# EAGLE design slidi (EAGLE 6.4)
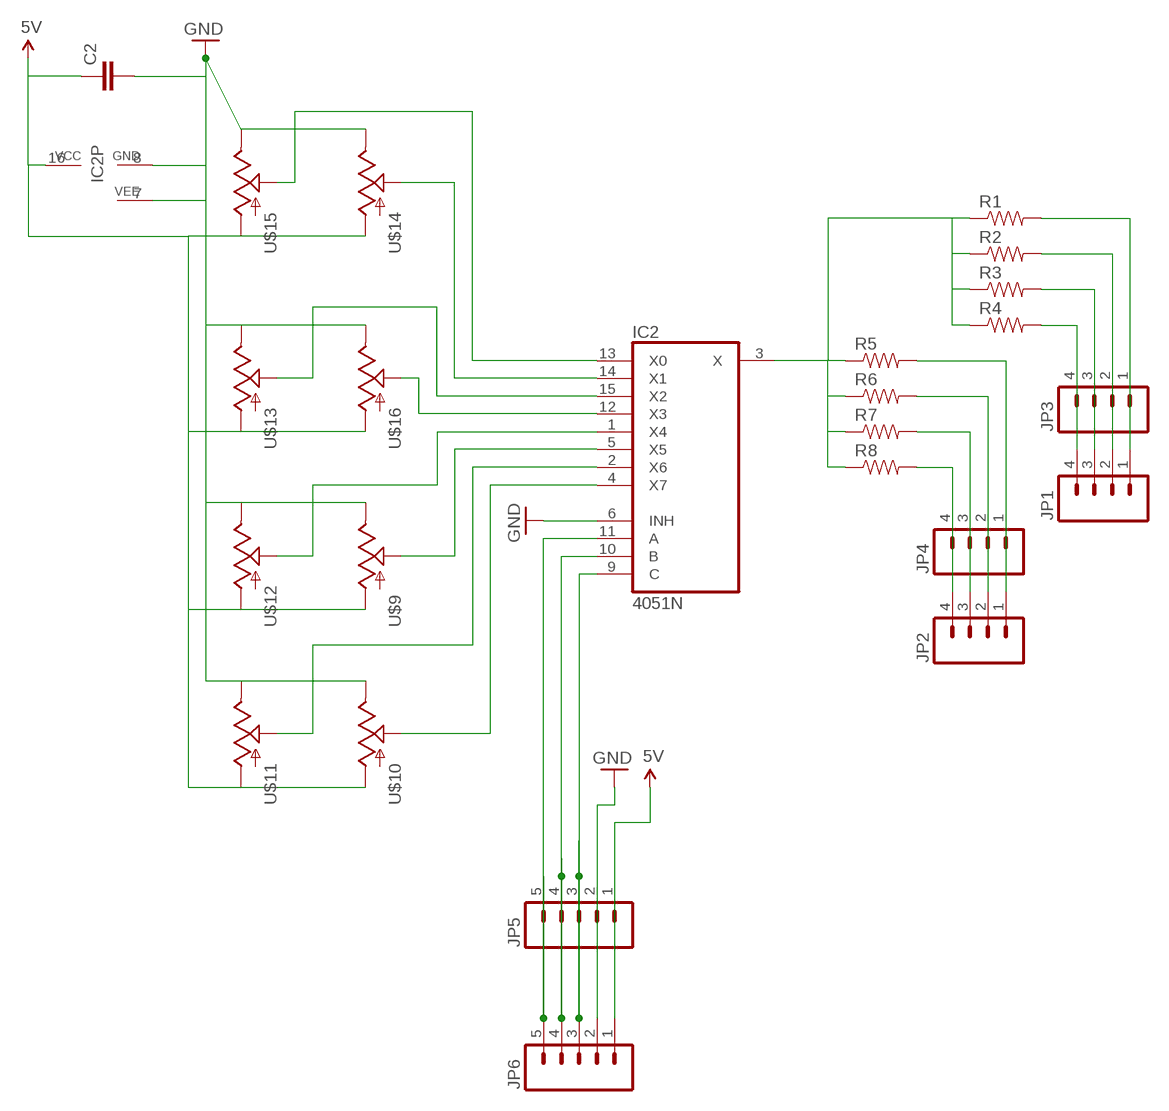
[diagram p0: schematic, sheet 1]

## Parts
C2  CAPPTH  [CAP-PTH-SMALL]
IC2  4051N  [DIL16]
JP1  M04PTH  [1X04]
JP2  M04PTH  [1X04]
JP3  M04PTH  [1X04]
JP4  M04PTH  [1X04]
JP5  M05PTH  [1X05]
JP6  M05PTH  [1X05]
R1  RESISTORAXIAL-0.3  [AXIAL-0.3]
R2  RESISTORAXIAL-0.3  [AXIAL-0.3]
R3  RESISTORAXIAL-0.3  [AXIAL-0.3]
R4  RESISTORAXIAL-0.3  [AXIAL-0.3]
R5  RESISTORAXIAL-0.3  [AXIAL-0.3]
R6  RESISTORAXIAL-0.3  [AXIAL-0.3]
R7  RESISTORAXIAL-0.3  [AXIAL-0.3]
R8  RESISTORAXIAL-0.3  [AXIAL-0.3]
U$9  SLIDEPOT  [SLIDEPOT]
U$10  SLIDEPOT  [SLIDEPOT]
U$11  SLIDEPOT  [SLIDEPOT]
U$12  SLIDEPOT  [SLIDEPOT]
U$13  SLIDEPOT  [SLIDEPOT]
U$14  SLIDEPOT  [SLIDEPOT]
U$15  SLIDEPOT  [SLIDEPOT]
U$16  SLIDEPOT  [SLIDEPOT]

## Nets
5V: C2.1 IC2.16(VCC) JP5.1 JP6.1 U$9.GND(A) U$10.GND(A) U$11.GND(A) U$12.GND(A) U$13.GND(A) U$14.GND(A) U$15.GND(A) U$16.GND(A)
GND: C2.2 IC2.6(INH) IC2.7(VEE) IC2.8(GND) JP5.2 JP6.2 U$9.5V(E) U$10.5V(E) U$11.5V(E) U$12.5V(E) U$13.5V(E) U$14.5V(E) U$15.5V(E) U$16.5V(E)
N$1: IC2.14(X1) U$14.WIPER(S)
N$9: IC2.13(X0) U$15.WIPER(S)
N$11: IC2.15(X2) U$13.WIPER(S)
N$12: IC2.12(X3) U$16.WIPER(S)
N$13: IC2.1(X4) U$12.WIPER(S)
N$14: IC2.5(X5) U$9.WIPER(S)
N$15: IC2.2(X6) U$11.WIPER(S)
N$16: IC2.4(X7) U$10.WIPER(S)
N$17: IC2.3(X) R1.P$1 R2.P$1 R3.P$1 R4.P$1 R5.P$1 R6.P$1 R7.P$1 R8.P$1
N$18: IC2.10(B) JP5.4 JP6.4
N$19: IC2.11(A) JP5.5 JP6.5
N$20: IC2.9(C) JP5.3 JP6.3
N$21: JP1.4 JP3.4 R4.P$2
N$22: JP1.3 JP3.3 R3.P$2
N$23: JP1.2 JP3.2 R2.P$2
N$24: JP1.1 JP3.1 R1.P$2
N$26: JP2.4 JP4.4 R8.P$2
N$27: JP2.3 JP4.3 R7.P$2
N$28: JP2.2 JP4.2 R6.P$2
N$29: JP2.1 JP4.1 R5.P$2

## Library data of the parts
C2 = SparkFun-Passives:CAP: Capacitor Standard 0603 ceramic capacitor, and 0.1" leaded capacitor.
IC2 = 40xx:4051: 8-channel ANALOG MULTIPLEXER
JP1-JP4 = SparkFun-Connectors:M04: Header 4 Standard 4-pin 0.1" header. Use with straight break away headers (SKU : PRT-00116), right angle break away headers (PRT-00553), swiss pins (PRT-00743), machine pins (PRT-00117), and female headers (PRT-00115). Molex polarized connector foot print use with SKU : PRT-08231 with associated crimp pins and housings. 1MM SMD Version SKU: PRT-10208
JP5 JP6 = SparkFun-Connectors:M05: Header 5 Standard 5-pin 0.1" header. Use with straight break away headers (SKU : PRT-00116), right angle break away headers (PRT-00553), swiss pins (PRT-00743), machine pins (PRT-00117), and female headers (PRT-00115). Molex polarized connector foot print use with SKU : PRT-08230 with associated crimp pins and housings.
R1-R8 = SparkFun-Resistors:RESISTOR: Resistor Basic schematic elements and footprints for 0603, 1206, and PTH resistors.
U$9-U$16 = slidepot:SLIDEPOT

## Board
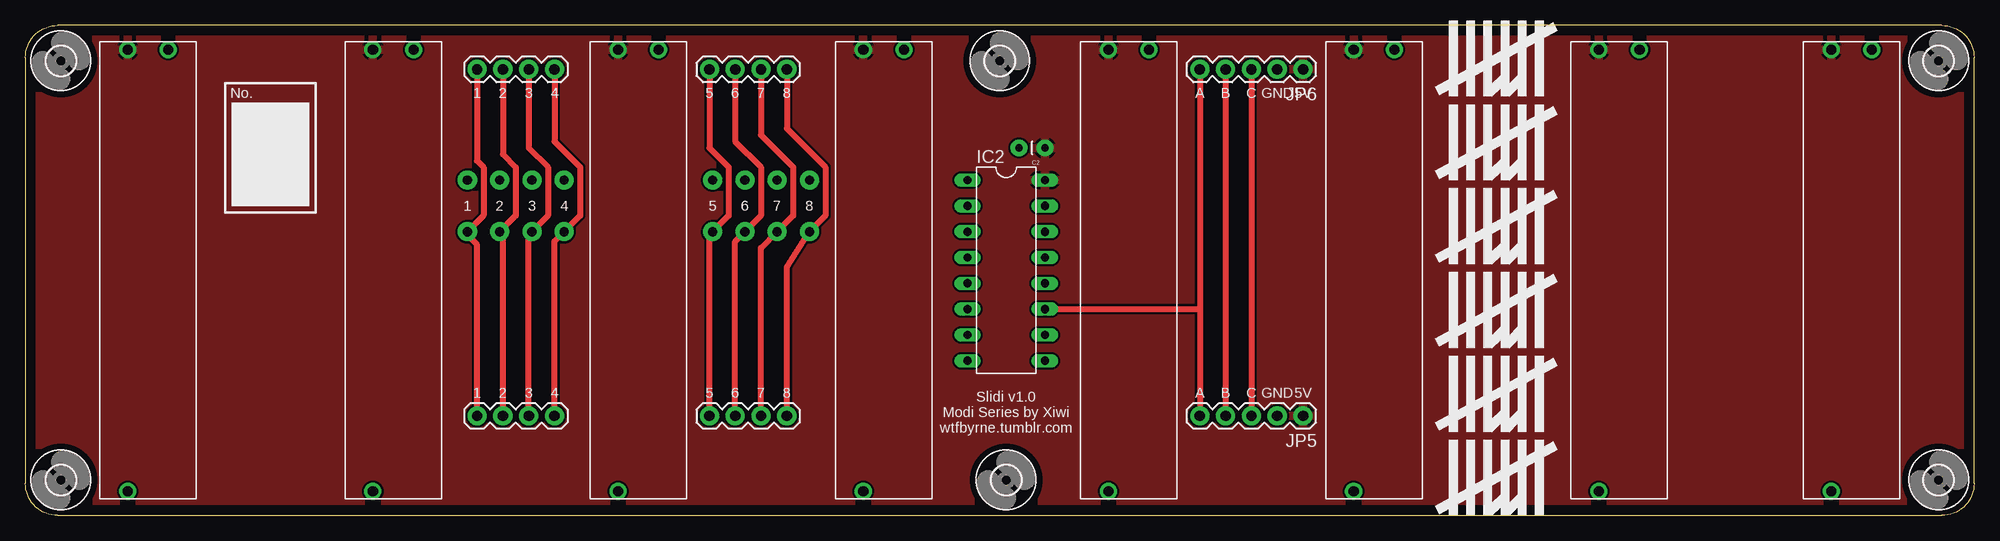
[diagram p1: board, top side]
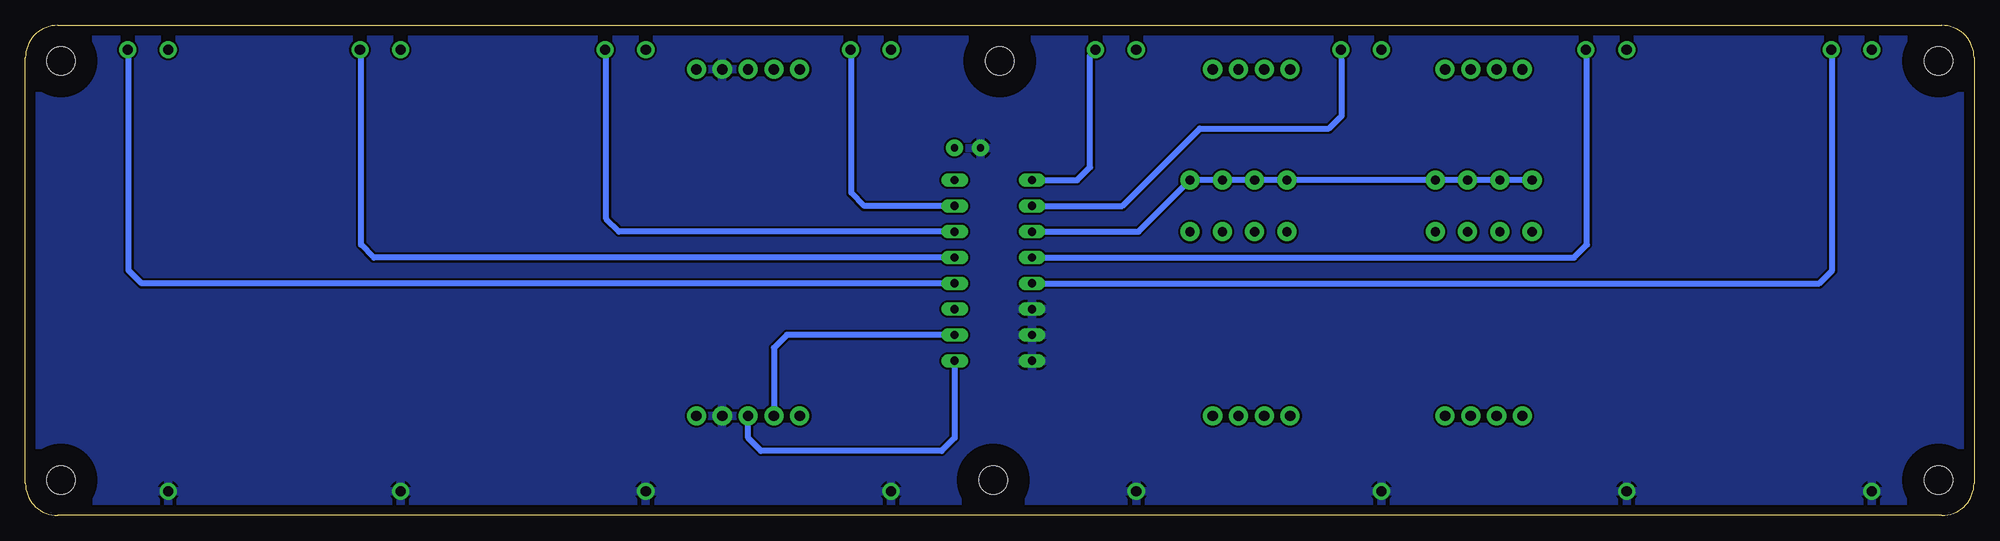
[diagram p2: board, bottom side, seen from below]

Size 191.77 x 48.26 mm. Coordinates in mm from the lower left corner, seen from the top.
Outline: 0,45.09 arc-90 3.17,48.26 188.59,48.26 arc-90 191.77,45.09 191.77,3.17 arc-90 188.59,0 3.17,0 arc-90 0,3.17 0,45.09
Copper layers (1*16): Top 0.035mm / dielectric 1.5mm / Bottom 0.035mm
Design rules "default": minimum track width 10mil, minimum drill 24mil, track to track 8mil, track to pad 8mil, pad to pad 8mil, via to via 8mil, smd to smd 8mil, copper to edge 40mil, drill to drill 8mil, minimum pad ring 10mil, minimum via ring 8mil, stop-mask expansion 4mil, vias tented up to drill 0mil, thermal gap 10mil

### Footprints (pad centres in the part's own frame; a part is rotated, then mirrored left to right if it is on the bottom)
CAP-PTH-SMALL = drill 0.7 pad 1.651: 1 0,0; 2 2.54,0
DIL16 = drill 0.813 long: 1 -8.89,-3.81; 2 -6.35,-3.81; 3 -3.81,-3.81; 4 -1.27,-3.81; 5 1.27,-3.81; 6 3.81,-3.81; 7 6.35,-3.81; 8 8.89,-3.81; 9 8.89,3.81; 10 6.35,3.81; 11 3.81,3.81; 12 1.27,3.81; 13 -1.27,3.81; 14 -3.81,3.81; 15 -6.35,3.81; 16 -8.89,3.81
1X04 = drill 1.016 pad 1.88: 1 0,0; 2 2.54,0; 3 5.08,0; 4 7.62,0
1X05 = drill 1.016 pad 1.88: 1 0,0; 2 2.54,0; 3 5.08,0; 4 7.62,0; 5 10.16,0
AXIAL-0.3 = drill 0.9 pad 1.88: P$1 -2.54,0; P$2 2.54,0
SLIDEPOT = drill 1 pad 1.676: 5V -21.75,2; GND 21.75,2; WIPER 21.75,-2
2,8 = hole 2.8: 0,0

### Placement (x,y rotation side)
C2  100.33,36.2 180 top
IC2  96.52,24.13 270 top
JP1  67.31,9.8 0 top
JP2  44.45,9.8 0 top
JP3  67.31,43.93 0 top
JP4  44.45,43.93 0 top
JP5  125.73,9.8 180 top
JP6  125.73,43.93 180 top
R1  67.63,30.48 270 top
R2  70.8,30.48 270 top
R3  73.98,30.48 270 top
R4  77.15,30.48 270 top
R5  43.5,30.48 270 top
R6  46.67,30.48 270 top
R7  49.85,30.48 270 top
R8  53.02,30.48 270 top
U$9  12.06,24.13 90 top
U$10  36.2,24.13 90 top
U$11  60.33,24.13 90 top
U$12  84.45,24.13 90 top
U$13  108.58,24.13 90 top
U$14  132.72,24.13 90 top
U$15  156.84,24.13 90 top
U$16  179.71,24.13 90 top
U$17  [2,8]  3.49,44.77 0 top
U$18  [2,8]  3.49,3.49 0 top
U$19  [2,8]  188.28,44.77 0 top
U$20  [2,8]  188.28,3.49 0 top
U$21  [2,8]  95.89,44.77 0 top
U$22  [2,8]  96.52,3.49 0 top
U$23  [XIWI]  138.75,33.02 0 top
U$24  [XIWI]  138.75,24.77 0 top
U$25  [XIWI]  138.75,41.27 0 top
U$26  [XIWI]  138.75,16.51 0 top
U$27  [XIWI]  138.75,8.26 0 top
U$28  [XIWI]  138.75,0 0 top

### Tracks (layer width: path | path; a pad name or v marks a point on that pad's centre or on a via)
5V
  pour Top: -2.54,50.8 194.31,50.8 194.31,-2.54 -2.54,-2.54
GND
  pour Bottom: 0,48.26 191.77,48.26 191.77,0 0,0
N$1
  Bottom 0.61: IC2.14 133.35,27.94 134.62,29.21 134.62,45.78 U$14.WIPER
N$9
  Bottom 0.61: IC2.13 157.48,25.4 158.75,26.67 158.75,45.78 U$15.WIPER
N$11
  Bottom 0.61: IC2.15 109.22,30.48 110.49,31.75 110.49,45.78 U$13.WIPER
N$12
  Bottom 0.61: IC2.12 180.34,22.86 181.61,24.13 181.61,45.78 U$16.WIPER
N$13
  Bottom 0.61: IC2.1 88.27,33.02 87,34.29 87,45.34 U$12.WIPER
N$14
  Bottom 0.61: IC2.5 15.24,22.86 13.97,24.13 13.97,45.78 U$9.WIPER
N$15
  Bottom 0.61: IC2.2 83.82,30.48 76.2,38.1 63.5,38.1 62.23,39.37 62.23,44.7 U$11.WIPER
N$16
  Bottom 0.61: IC2.4 39.37,25.4 38.1,26.67 38.1,45.34 U$10.WIPER
N$17
  Bottom 0.61: R5.P$1 R6.P$1 R7.P$1 R8.P$1 R1.P$1 R2.P$1 R3.P$1 R4.P$1 82.23,27.94 IC2.3
N$18
  Top 0.61: JP6.4 JP5.4
  Bottom 0.61: IC2.10 116.84,17.78 118.11,16.51 JP5.4
N$19
  Top 0.61: JP6.5 115.57,20.32 | 115.57,20.32 JP5.5 | IC2.11 115.57,20.32
N$20
  Top 0.61: JP6.3 JP5.3
  Bottom 0.61: IC2.9 100.33,7.62 101.6,6.35 119.38,6.35 120.65,7.62 JP5.3
N$21
  Top 0.61: JP3.4 74.93,38.1 78.74,34.29 78.74,29.53 R4.P$2 74.93,24.45 JP1.4
N$22
  Top 0.61: JP3.3 72.39,37.47 75.56,34.29 75.56,29.53 R3.P$2 72.39,26.35 JP1.3
N$23
  Top 0.61: JP3.2 69.85,36.83 72.39,34.29 72.39,29.53 R2.P$2 69.85,26.99 JP1.2
N$24
  Top 0.61: JP3.1 67.31,36.2 69.22,34.29 69.22,29.53 R1.P$2 67.31,27.62 JP1.1
N$26
  Top 0.61: JP2.4 52.07,26.99 R8.P$2 54.61,29.53 54.61,34.29 52.07,36.83 JP4.4
N$27
  Top 0.61: JP2.3 49.53,27.3 49.85,27.62 R7.P$2 51.44,29.53 51.44,34.29 49.53,36.2 JP4.3
N$28
  Top 0.61: JP2.2 46.99,27.3 46.67,27.62 R6.P$2 48.26,29.53 48.26,34.29 46.99,35.56 JP4.2
N$29
  Top 0.61: JP2.1 44.45,26.67 43.5,27.62 R5.P$2 45.09,29.53 45.09,34.29 44.45,34.92 JP4.1

### Text on the board
tPlace: No. | 1 | 2 | 3 | 4 | 5 | 6 | 7 | 8 | A | B | C | GND | 5V | 1 | 2 | 3 | 4 | 5 | 6 | 7 | 8 | 1 | 2 | 3 | 4 | 5 | 6 | 7 | 8 | A | B | C | GND | 5V | Slidi v1.0 / Modi Series by Xiwi / wtfbyrne.tumblr.com